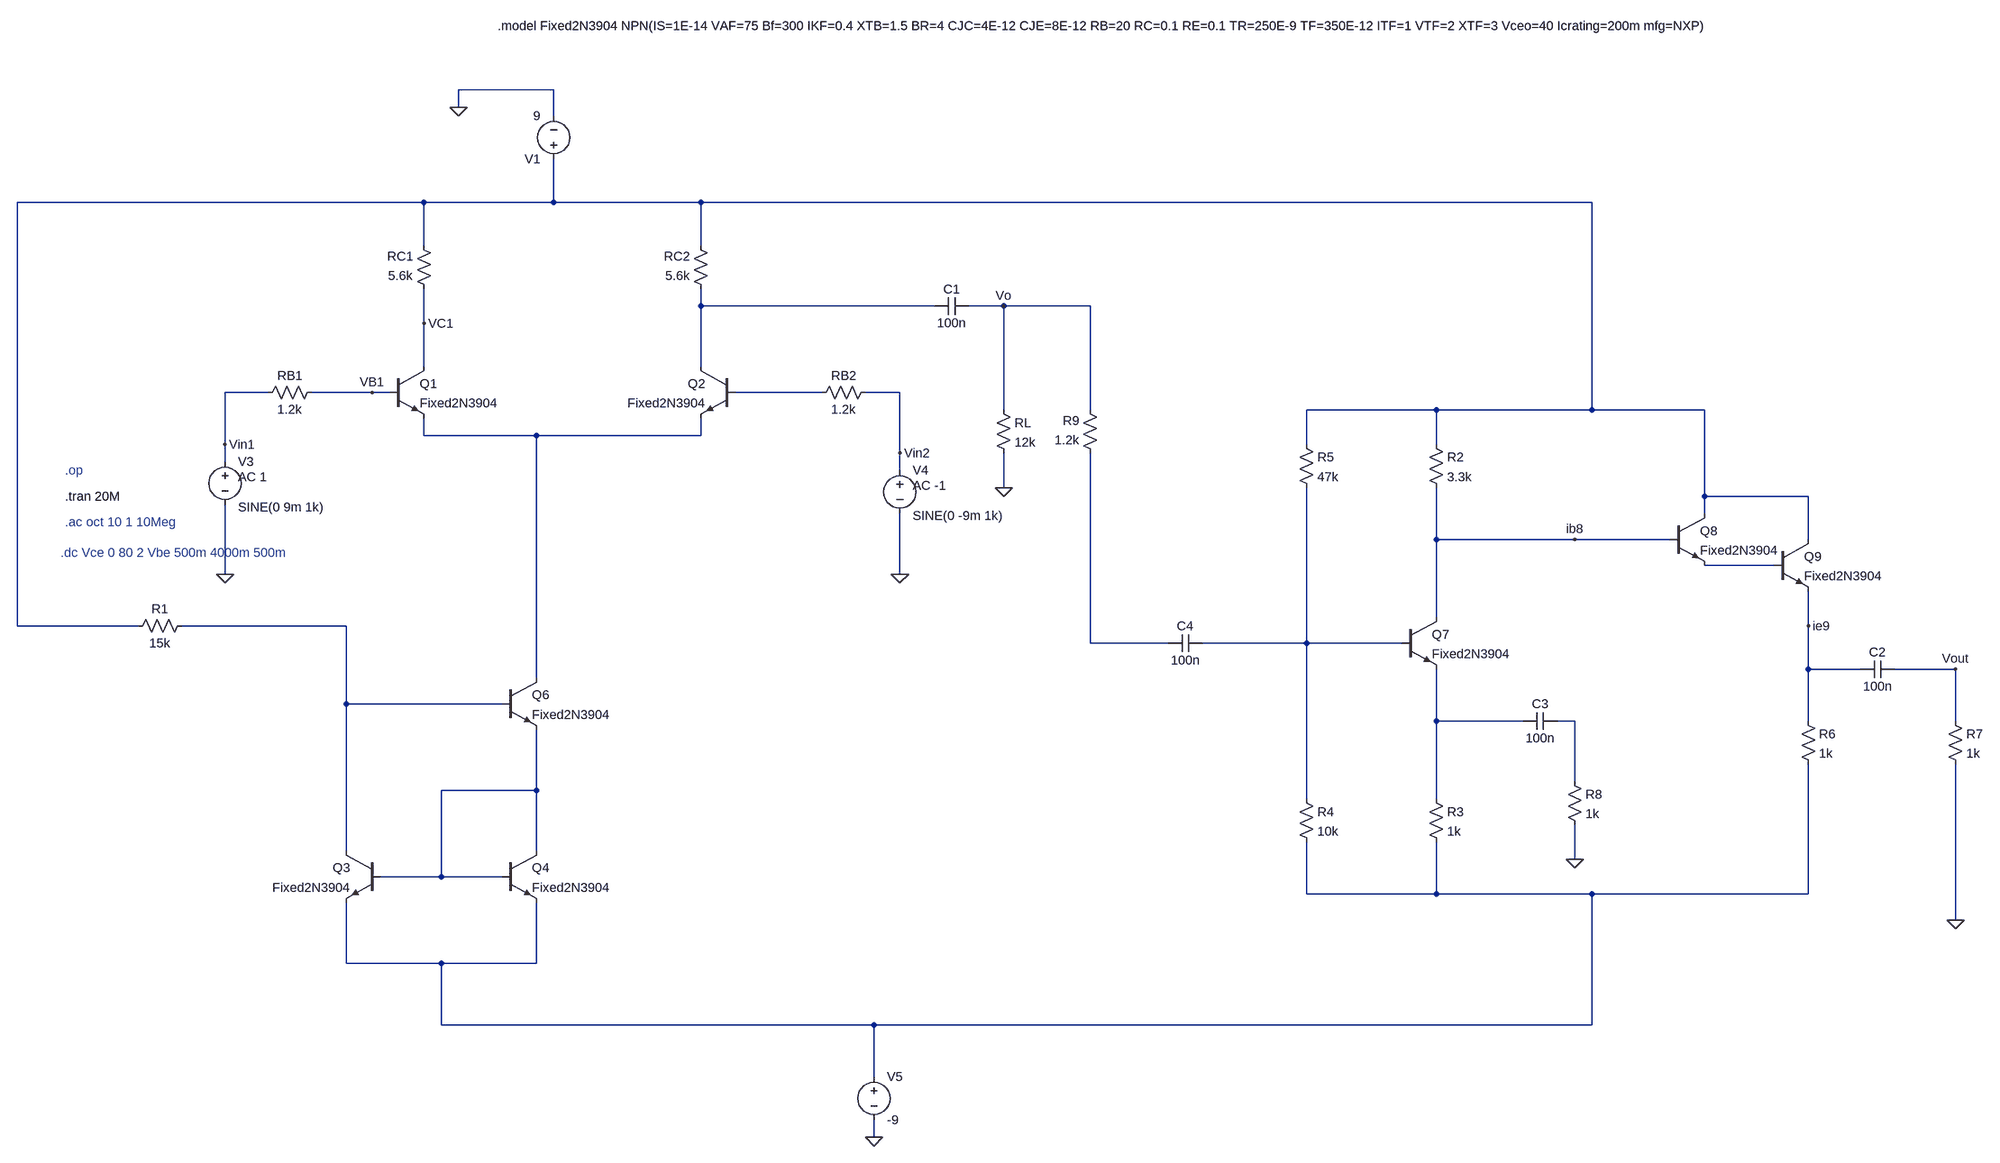
[diagram p0: schematic BTL.asc]
BTL.asc, the LTspice schematic file:
Version 4
SHEET 1 5488 2052
WIRE 256 -64 80 -64
WIRE 80 -32 80 -64
WIRE 256 -16 256 -64
WIRE 16 144 -736 144
WIRE 256 144 256 64
WIRE 256 144 16 144
WIRE 528 144 256 144
WIRE 2176 144 528 144
WIRE 16 224 16 144
WIRE 528 224 528 144
WIRE 528 336 528 304
WIRE 960 336 528 336
WIRE 1088 336 1024 336
WIRE 1248 336 1088 336
WIRE 16 368 16 304
WIRE 16 448 16 368
WIRE 528 448 528 336
WIRE -272 496 -352 496
WIRE -80 496 -192 496
WIRE -48 496 -80 496
WIRE 752 496 592 496
WIRE 896 496 832 496
WIRE 1088 528 1088 336
WIRE 1248 528 1248 336
WIRE 1888 528 1648 528
WIRE 2176 528 2176 144
WIRE 2176 528 1888 528
WIRE 2384 528 2176 528
WIRE 16 576 16 544
WIRE 224 576 16 576
WIRE 528 576 528 544
WIRE 528 576 224 576
WIRE -352 592 -352 496
WIRE 1648 592 1648 528
WIRE 1888 592 1888 528
WIRE 896 608 896 496
WIRE -352 624 -352 592
WIRE 896 640 896 608
WIRE 1088 672 1088 608
WIRE 2384 688 2384 528
WIRE 2576 688 2384 688
WIRE 2384 720 2384 688
WIRE 1888 768 1888 672
WIRE 2144 768 1888 768
WIRE 2320 768 2144 768
WIRE 2576 768 2576 688
WIRE 2512 816 2384 816
WIRE -352 832 -352 704
WIRE 896 832 896 720
WIRE 1888 912 1888 768
WIRE -736 928 -736 144
WIRE -512 928 -736 928
WIRE -128 928 -432 928
WIRE 2576 928 2576 864
WIRE 1248 960 1248 608
WIRE 1392 960 1248 960
WIRE 1648 960 1648 672
WIRE 1648 960 1456 960
WIRE 1824 960 1648 960
WIRE 2576 1008 2576 928
WIRE 2672 1008 2576 1008
WIRE 2848 1008 2736 1008
WIRE 224 1024 224 576
WIRE -128 1072 -128 928
WIRE 160 1072 -128 1072
WIRE 1888 1104 1888 1008
WIRE 2048 1104 1888 1104
WIRE 2144 1104 2112 1104
WIRE 2576 1104 2576 1008
WIRE 2848 1104 2848 1008
WIRE 2144 1216 2144 1104
WIRE 224 1232 224 1120
WIRE 224 1232 48 1232
WIRE 1648 1248 1648 960
WIRE 1888 1248 1888 1104
WIRE -128 1344 -128 1072
WIRE 224 1344 224 1232
WIRE 2144 1360 2144 1296
WIRE 48 1392 48 1232
WIRE 48 1392 -64 1392
WIRE 160 1392 48 1392
WIRE 1648 1424 1648 1328
WIRE 1888 1424 1888 1328
WIRE 1888 1424 1648 1424
WIRE 2176 1424 1888 1424
WIRE 2576 1424 2576 1184
WIRE 2576 1424 2176 1424
WIRE 2848 1472 2848 1184
WIRE -128 1552 -128 1440
WIRE 48 1552 -128 1552
WIRE 224 1552 224 1440
WIRE 224 1552 48 1552
WIRE 48 1728 48 1552
WIRE 848 1728 48 1728
WIRE 2176 1728 2176 1424
WIRE 2176 1728 848 1728
WIRE 848 1824 848 1728
WIRE 848 1936 848 1904
FLAG 896 832 0
FLAG -352 832 0
FLAG 80 -32 0
FLAG -80 496 VB1
FLAG 16 368 VC1
FLAG 848 1936 0
FLAG -352 592 Vin1
FLAG 896 608 Vin2
FLAG 1088 336 Vo
FLAG 2144 768 ib8
FLAG 2576 928 ie9
FLAG 2848 1472 0
FLAG 2848 1008 Vout
FLAG 2144 1360 0
FLAG 1088 672 0
DATAFLAG -352 496 "Ib(Q1)"
DATAFLAG 112 144 "Ic(Q1)"
DATAFLAG -736 368 "I(R1)"
DATAFLAG 224 816 "Ic(Q6)"
DATAFLAG 1760 960 "Ib(Q7)"
SYMBOL voltage 256 80 R180
WINDOW 123 0 0 Left 0
WINDOW 39 0 0 Left 0
SYMATTR InstName V1
SYMATTR Value 9
SYMBOL npn -48 448 R0
SYMATTR InstName Q1
SYMATTR Value Fixed2N3904
SYMBOL npn 592 448 M0
SYMATTR InstName Q2
SYMATTR Value Fixed2N3904
SYMBOL res -176 480 R90
WINDOW 0 0 56 VBottom 2
WINDOW 3 32 56 VTop 2
SYMATTR InstName RB1
SYMATTR Value 1.2k
SYMBOL res 848 480 R90
WINDOW 0 0 56 VBottom 2
WINDOW 3 32 56 VTop 2
SYMATTR InstName RB2
SYMATTR Value 1.2k
SYMBOL res 32 320 R180
WINDOW 0 36 76 Left 2
WINDOW 3 36 40 Left 2
SYMATTR InstName RC1
SYMATTR Value 5.6k
SYMBOL res 544 320 R180
WINDOW 0 36 76 Left 2
WINDOW 3 36 40 Left 2
SYMATTR InstName RC2
SYMATTR Value 5.6k
SYMBOL voltage -352 608 R0
WINDOW 3 24 100 Left 2
WINDOW 123 24 44 Left 2
WINDOW 39 0 0 Left 0
SYMATTR Value SINE(0 9m 1k)
SYMATTR Value2 AC 1
SYMATTR InstName V3
SYMBOL voltage 896 624 R0
WINDOW 3 24 100 Left 2
WINDOW 123 24 44 Left 2
WINDOW 39 0 0 Left 0
SYMATTR Value SINE(0 -9m 1k)
SYMATTR Value2 AC -1
SYMATTR InstName V4
SYMBOL cap 1024 320 R90
WINDOW 0 0 32 VBottom 2
WINDOW 3 32 32 VTop 2
SYMATTR InstName C1
SYMATTR Value 100n
SYMATTR SpiceLine V=16
SYMBOL npn 160 1024 R0
SYMATTR InstName Q6
SYMATTR Value Fixed2N3904
SYMBOL res -528 944 R270
WINDOW 0 32 56 VTop 2
WINDOW 3 0 56 VBottom 2
SYMATTR InstName R1
SYMATTR Value 15k
SYMBOL voltage 848 1808 R0
WINDOW 123 0 0 Left 0
WINDOW 39 0 0 Left 0
SYMATTR InstName V5
SYMATTR Value -9
SYMBOL npn -64 1344 M0
SYMATTR InstName Q3
SYMATTR Value Fixed2N3904
SYMBOL npn 160 1344 R0
SYMATTR InstName Q4
SYMATTR Value Fixed2N3904
SYMBOL npn 1824 912 R0
SYMATTR InstName Q7
SYMATTR Value Fixed2N3904
SYMBOL npn 2320 720 R0
SYMATTR InstName Q8
SYMATTR Value Fixed2N3904
SYMBOL npn 2512 768 R0
SYMATTR InstName Q9
SYMATTR Value Fixed2N3904
SYMBOL res 1872 576 R0
SYMATTR InstName R2
SYMATTR Value 3.3k
SYMBOL res 1872 1232 R0
SYMATTR InstName R3
SYMATTR Value 1k
SYMBOL res 1632 1232 R0
SYMATTR InstName R4
SYMATTR Value 10k
SYMBOL res 1632 576 R0
SYMATTR InstName R5
SYMATTR Value 47k
SYMBOL res 2560 1088 R0
SYMATTR InstName R6
SYMATTR Value 1k
SYMBOL res 2832 1088 R0
SYMATTR InstName R7
SYMATTR Value 1k
SYMBOL cap 2736 992 R90
WINDOW 0 0 32 VBottom 2
WINDOW 3 32 32 VTop 2
SYMATTR InstName C2
SYMATTR Value 100n
SYMBOL cap 2112 1088 R90
WINDOW 0 0 32 VBottom 2
WINDOW 3 32 32 VTop 2
SYMATTR InstName C3
SYMATTR Value 100n
SYMBOL cap 1456 944 R90
WINDOW 0 0 32 VBottom 2
WINDOW 3 32 32 VTop 2
SYMATTR InstName C4
SYMATTR Value 100n
SYMBOL res 2128 1200 R0
SYMATTR InstName R8
SYMATTR Value 1k
SYMBOL res 1264 624 R180
WINDOW 0 36 76 Left 2
WINDOW 3 36 40 Left 2
SYMATTR InstName R9
SYMATTR Value 1.2k
SYMBOL res 1072 512 R0
SYMATTR InstName RL
SYMATTR Value 12k
TEXT -648 640 Left 2 ;.op
TEXT -648 688 Left 2 !.tran 20M
TEXT -648 736 Left 2 ;.ac oct 10 1 10Meg
TEXT 152 -328 Left 2 !.model Fixed2N3904 NPN(IS=1E-14 VAF=75 Bf=300 IKF=0.4 XTB=1.5 BR=4 CJC=4E-12 CJE=8E-12 RB=20 RC=0.1 RE=0.1 TR=250E-9 TF=350E-12 ITF=1 VTF=2 XTF=3 Vceo=40 Icrating=200m mfg=NXP)
TEXT -656 792 Left 2 ;.dc Vce 0 80 2 Vbe 500m 4000m 500m

The netlist it stands for:
* BTL.asc
V1 N001 0 9
Q1 VC1 VB1 N004 0 Fixed2N3904
Q2 N002 N003 N004 0 Fixed2N3904
RB1 VB1 Vin1 1.2k
RB2 Vin2 N003 1.2k
RC1 VC1 N001 5.6k
RC2 N002 N001 5.6k
V3 Vin1 0 SINE(0 9m 1k) AC 1
V4 Vin2 0 SINE(0 -9m 1k) AC -1
C1 Vo N002 100n V=16
Q6 N004 N006 N011 0 Fixed2N3904
R1 N001 N006 15k
V5 N012 0 -9
Q3 N006 N011 N012 0 Fixed2N3904
Q4 N011 N011 N012 0 Fixed2N3904
Q7 ib8 N008 N009 0 Fixed2N3904
Q8 N001 ib8 N005 0 Fixed2N3904
Q9 N001 N005 ie9 0 Fixed2N3904
R2 N001 ib8 3.3k
R3 N009 N012 1k
R4 N008 N012 10k
R5 N001 N008 47k
R6 ie9 N012 1k
R7 Vout 0 1k
C2 Vout ie9 100n
C3 N010 N009 100n
C4 N008 N007 100n
R8 N010 0 1k
R9 N007 Vo 1.2k
RL Vo 0 12k
.model NPN NPN
.model PNP PNP
.lib standard.bjt
* .op
.tran 20M
* .ac oct 10 1 10Meg
.model Fixed2N3904 NPN(IS=1E-14 VAF=75 Bf=300 IKF=0.4 XTB=1.5 BR=4 CJC=4E-12 CJE=8E-12 RB=20 RC=0.1 RE=0.1 TR=250E-9 TF=350E-12 ITF=1 VTF=2 XTF=3 Vceo=40 Icrating=200m mfg=NXP)
* .dc Vce 0 80 2 Vbe 500m 4000m 500m
.backanno
.end